# EAGLE design TestBoard2 (EAGLE 9.6.2)

## Sheet 1 of 5
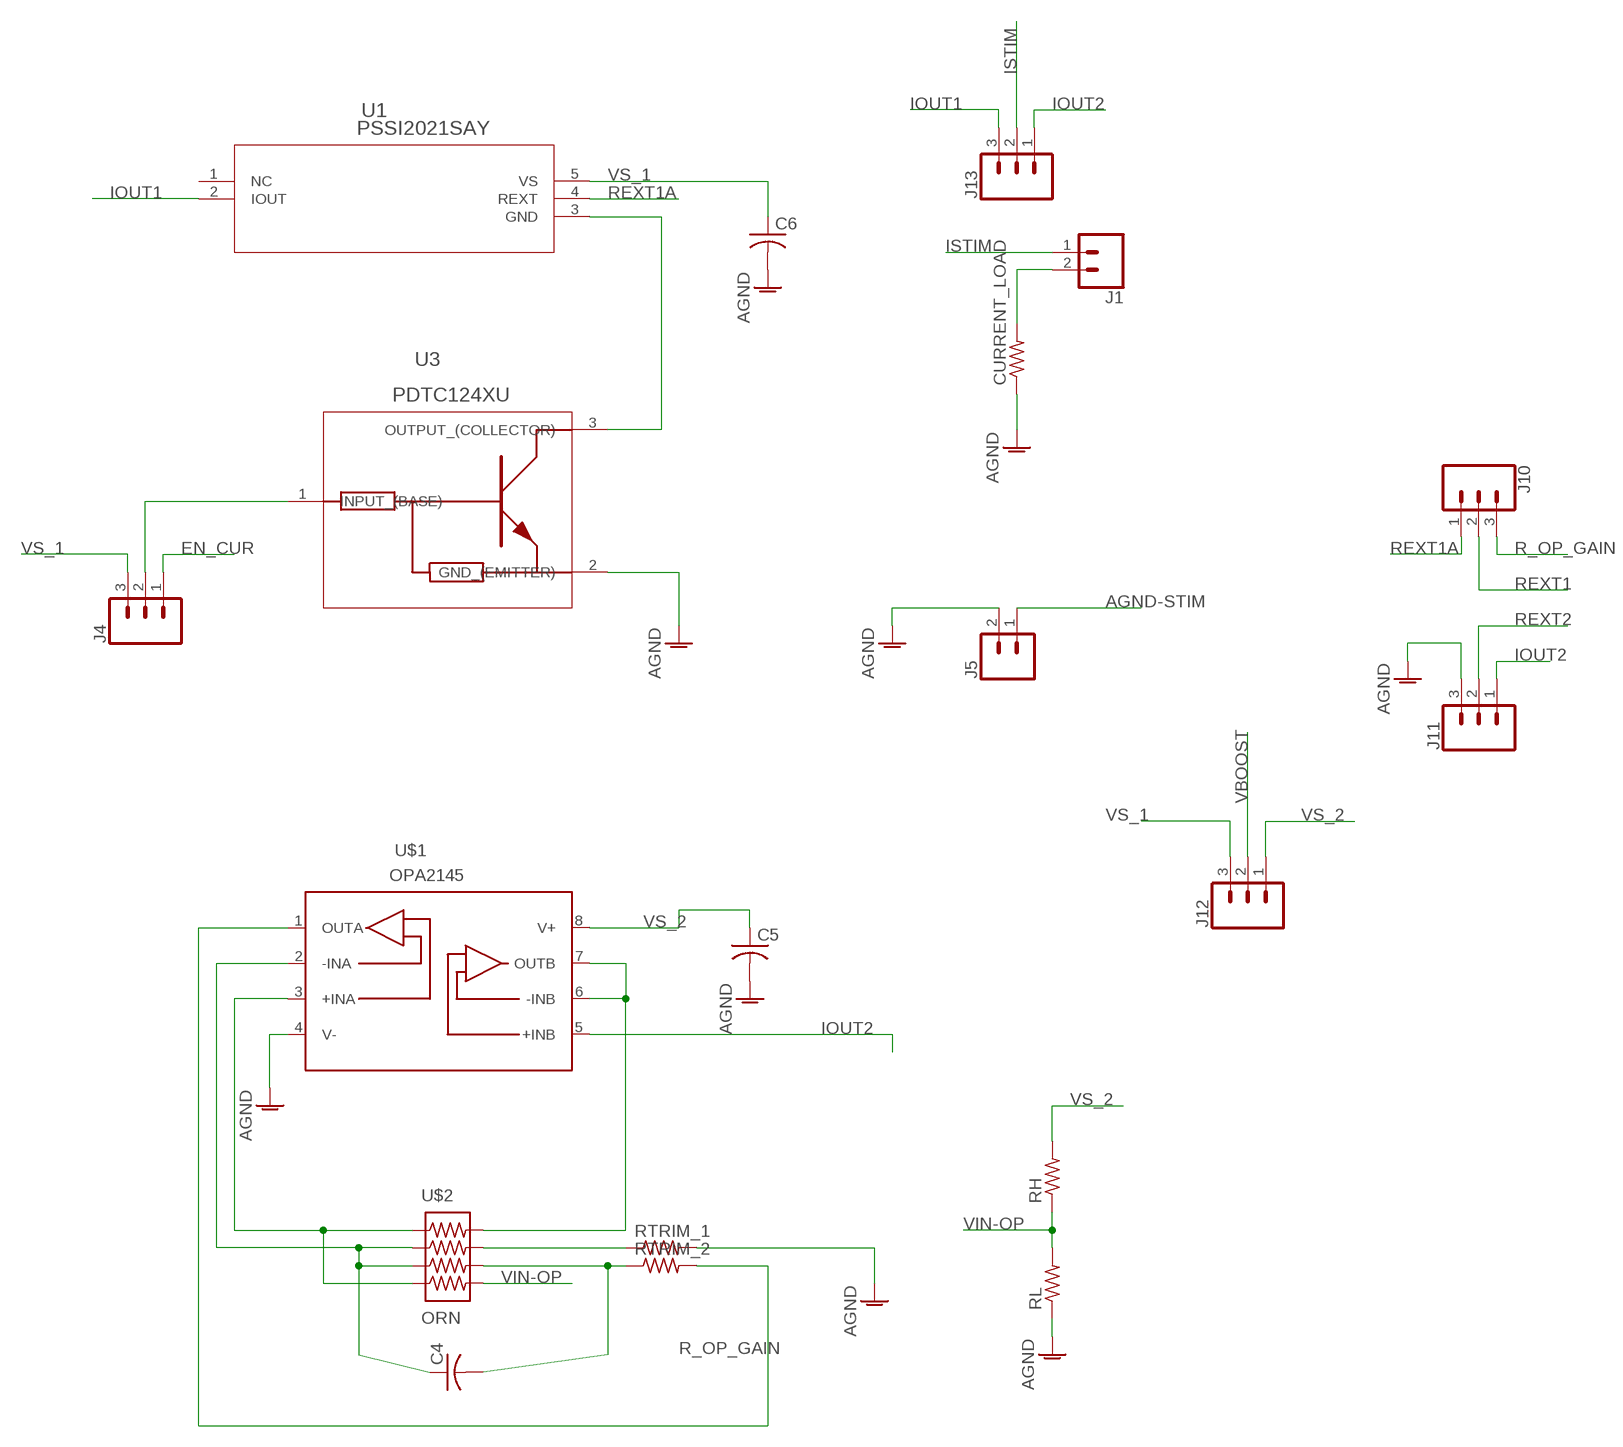
[diagram p0: schematic, sheet 1]

### Parts
C4  C-USC0603  [C0603]
C5  C-USC0603  [C0603]
C6  C-USC0603  [C0603]
CURRENT_LOAD  R-US_0204/7  [0204/7]
J1  CONN_02LOCK  [1X02_LOCK]
J4  CONN_03LOCK  [1X03_LOCK]
J5  CONN_02  [1X02]
J10  CONN_03  [1X03]
J11  CONN_03  [1X03]
J12  CONN_03LOCK  [1X03_LOCK]
J13  CONN_03LOCK  [1X03_LOCK]
RH  R-US_R0603  [R0603]
RL  R-US_R0603  [R0603]
RTRIM_1  R-US_R0603  [R0603]
RTRIM_2  R-US_R0603  [R0603]
U1  PSSI2021SAY  [SOT353_NXP]
U3  PDTC124XU  [SOT323_NXP]
U$1  OPA2145  [8-VSSOP]
U$2  ORN  [8-TSSOP]

### Nets
AGND: C5.2 C6.2 CURRENT_LOAD.1 J5.2 J11.3 RL.1 RTRIM_1.2 U3.2(GND_(EMITTER)) U$1.4(V-) ; also sheet 3
AGND-STIM: J5.1 ; also sheet 4
EN_CUR: J4.1 ; also sheet 5
IOUT1: J13.3 U1.2(IOUT)
IOUT2: J11.1 J13.1 U$1.5(+INB)
ISTIM: J1.1 J13.2 ; also sheet 4
N$1: J4.2 U3.1(INPUT_(BASE))
N$3: CURRENT_LOAD.2 J1.2
N$4: C4.1 U$1.2(-INA) U$2.2 U$2.3
N$6: U1.3(GND) U3.3(OUTPUT_(COLLECTOR))
N$8: U$1.3(+INA) U$2.1 U$2.4
N$9: U$1.6(-INB) U$1.7(OUTB) U$2.8
N$11: RTRIM_1.1 U$2.7
N$12: C4.2 RTRIM_2.1 U$2.6
R_OP_GAIN: J10.3 RTRIM_2.2 U$1.1(OUTA)
REXT1: J10.2 ; also sheet 3
REXT1A: J10.1 U1.4(REXT)
REXT2: J11.2 ; also sheet 3
VBOOST: J12.2 ; also sheet 2,3,4
VIN-OP: RH.1 RL.2 U$2.5
VS_1: C6.1 J4.3 J12.3 U1.5(VS)
VS_2: C5.1 J12.1 RH.2 U$1.8(V+)
Unconnected: U1.1(NC)

## Sheet 2 of 5: Voltage Boost Circuit
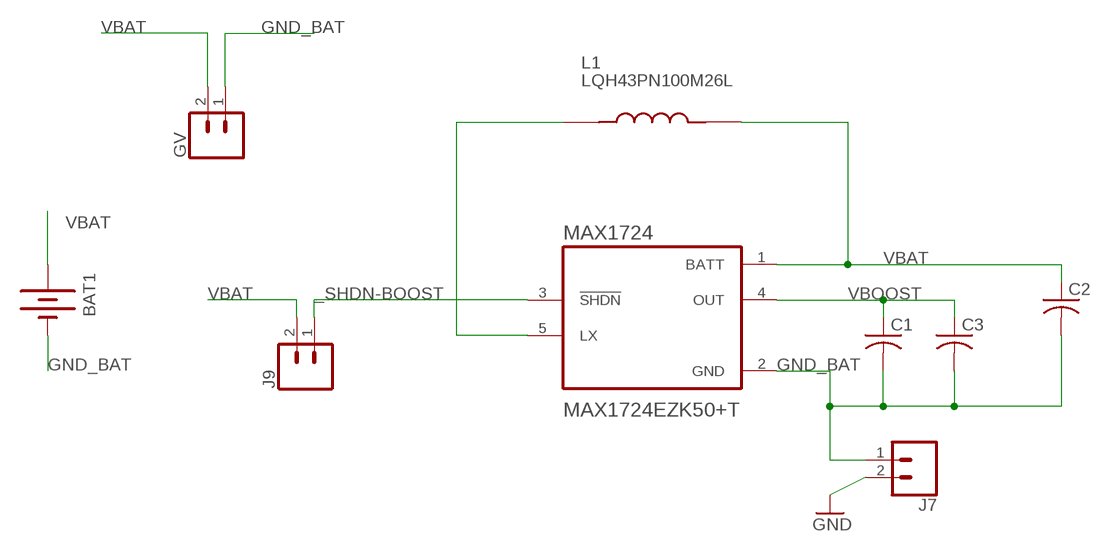
[diagram p1: schematic, sheet 2]

### Parts
BAT1  BATTERYBU2032SM  [BU2032SM]
C1  C-USC1206  [C1206]
C2  C-USC1206  [C1206]
C3  C-USC0603  [C0603]
GV  CONN_02  [1X02]
J7  CONN_02  [1X02]
J9  CONN_02  [1X02]
L1  LQH43PN100M26L  [IND_LQH43PN100M26L]
MAX1724  MAX1724EZK50+T  [SOT95P275X110-5N]

### Nets
_SHDN-BOOST: J9.1 MAX1724.3(!SHDN) ; also sheet 5
GND: J7.2 ; also sheet 4,5
GND_BAT: BAT1.P$2(-) C1.2 C2.2 C3.2 GV.1 J7.1 MAX1724.2(GND)
N$7: L1.1 MAX1724.5(LX)
VBAT: BAT1.P$1(+) C2.1 GV.2 J9.2 L1.2 MAX1724.1(BATT) ; also sheet 5
VBOOST: C1.1 C3.1 MAX1724.4(OUT) ; also sheet 1,3,4

## Sheet 3 of 5: Digital Potentiometer
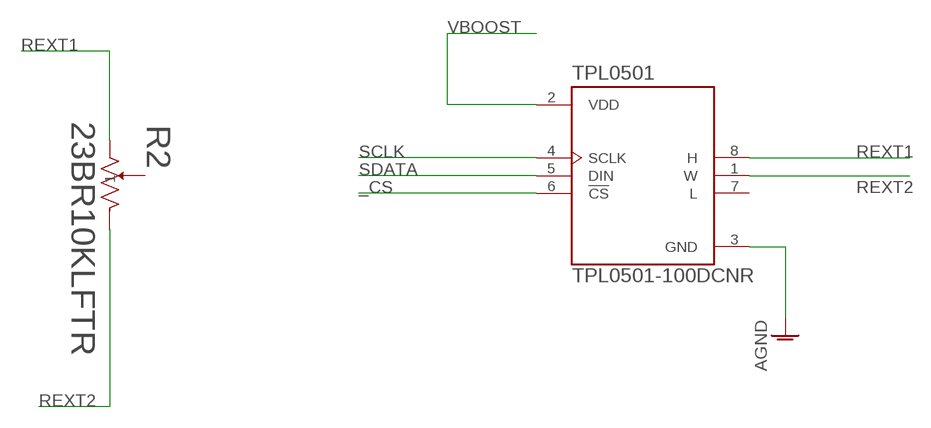
[diagram p2: schematic, sheet 3]

### Parts
R2  23BR10KLFTR  [RES3_23B_TTE]
TPL0501  TPL0501-100DCNR  [SOT65P280X145-8N]

### Nets
_CS: TPL0501.6(!CS!) ; also sheet 5
AGND: TPL0501.3(GND) ; also sheet 1
REXT1: R2.1 TPL0501.8(H) ; also sheet 1
REXT2: R2.3 TPL0501.1(W) ; also sheet 1
SCLK: TPL0501.4(SCLK) ; also sheet 5
SDATA: TPL0501.5(DIN) ; also sheet 5
VBOOST: TPL0501.2(VDD) ; also sheet 1,2,4
Unconnected: R2.2 TPL0501.7(L)

## Sheet 4 of 5: Electrode H-Bridge Multiplexer
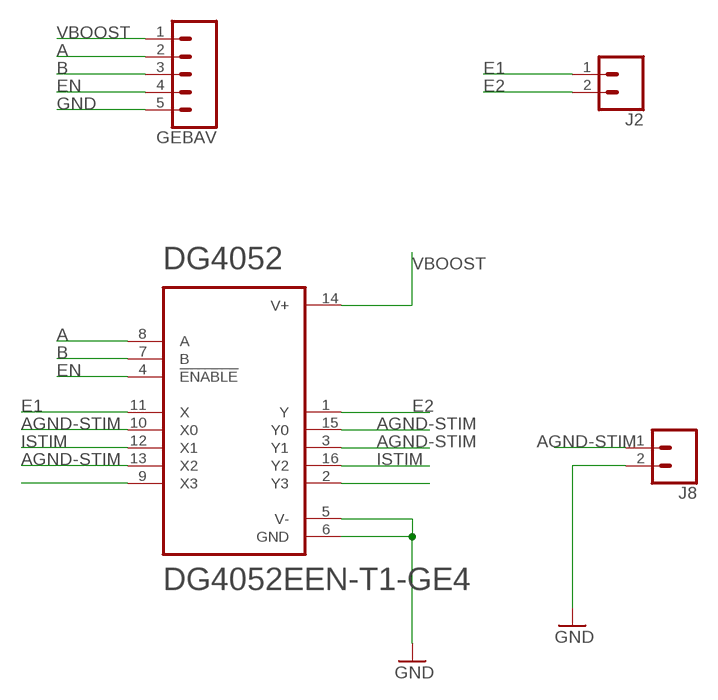
[diagram p3: schematic, sheet 4]

### Parts
DG4052  DG4052EEN-T1-GE4  [QFN40P260X180X60-16N]
GEBAV  CONN_05LOCK  [1X05_LOCK]
J2  CONN_02  [1X02]
J8  CONN_02  [1X02]

### Nets
A: DG4052.8(A) GEBAV.2 ; also sheet 5
AGND-STIM: DG4052.3(Y1) DG4052.10(X0) DG4052.13(X2) DG4052.15(Y0) J8.1 ; also sheet 1
B: DG4052.7(B) GEBAV.3 ; also sheet 5
E1: DG4052.11(X) J2.1
E2: DG4052.1(Y) J2.2
EN: DG4052.4(!ENABLE) GEBAV.4 ; also sheet 5
GND: DG4052.5(V-) DG4052.6(GND) GEBAV.5 J8.2 ; also sheet 2,5
ISTIM: DG4052.12(X1) DG4052.16(Y2) ; also sheet 1
N$2: DG4052.9(X3)
N$5: DG4052.2(Y3)
VBOOST: DG4052.14(V+) GEBAV.1 ; also sheet 1,2,3

## Sheet 5 of 5: MSP430
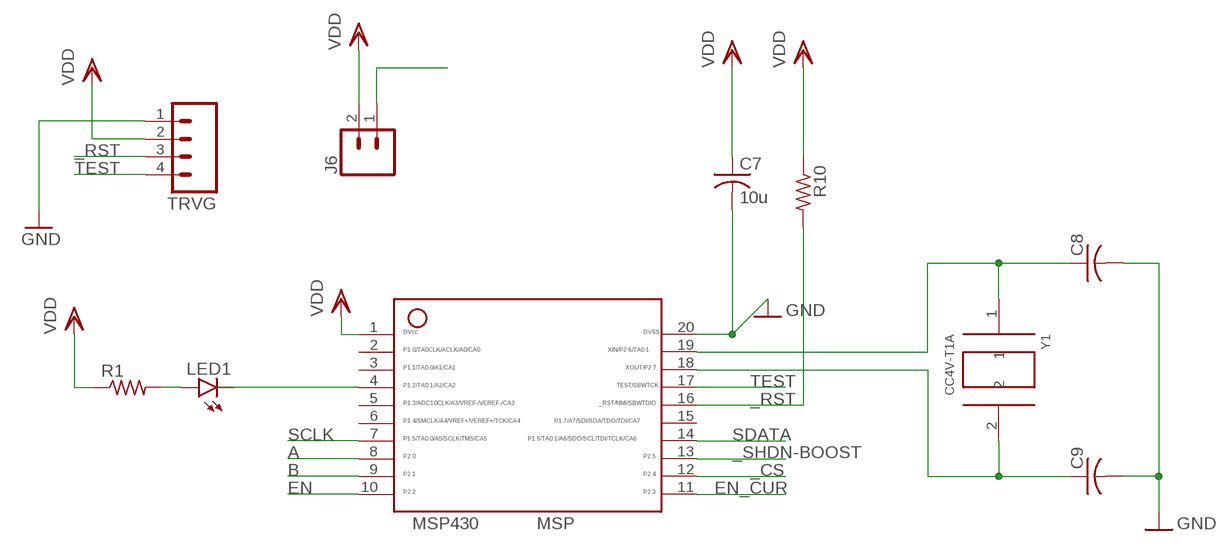
[diagram p4: schematic, sheet 5]

### Parts
C7  10u  C-USC1206  [C1206]
C8  C-USC0603  [C0603]
C9  C-USC0603  [C0603]
J6  CONN_02  [1X02]
LED1  LEDCHIPLED_0603  [CHIPLED_0603]
MSP430  MSP  MSP430  [20_PIN]
R1  R-US_R1206  [R1206]
R10  R-US_R1206  [R1206]
TRVG  M04LOCK  [1X04_LOCK]
Y1  CC4V-T1A  [CC4V-T1A]

### Nets
_CS: MSP430.12 ; also sheet 3
_RST: MSP430.16 R10.2 TRVG.3
_SHDN-BOOST: MSP430.13 ; also sheet 2
A: MSP430.8 ; also sheet 4
B: MSP430.9 ; also sheet 4
EN: MSP430.10 ; also sheet 4
EN_CUR: MSP430.11 ; also sheet 1
GND: C7.2 C8.2 C9.2 MSP430.20 TRVG.1 ; also sheet 2,4
N$10: LED1.C MSP430.4
N$13: LED1.A R1.2
N$14: C8.1 MSP430.19 Y1.1
N$15: C9.1 MSP430.18 Y1.2
SCLK: MSP430.7 ; also sheet 3
SDATA: MSP430.14 ; also sheet 3
TEST: MSP430.17 TRVG.4
VBAT: J6.1 ; also sheet 2
VDD: C7.1 J6.2 MSP430.1 R1.1 R10.1 TRVG.2
Unconnected: MSP430.2 MSP430.3 MSP430.5 MSP430.6 MSP430.15

## Library data of the parts
BAT1 = ELEC327:BATTERY: Battery Holders Various common sizes : AA, AAA, 20mm coin cell and 12mm coin cell. 20MM_4LEGS, BATT-10373
C1-C9 = rcl:C-US: CAPACITOR, American symbol; SPICEPREFIX: C
CURRENT_LOAD R1 R10 RH RL RTRIM_1 RTRIM_2 = rcl:R-US_: RESISTOR, American symbol; SPICEPREFIX: R
DG4052 = DG4052EEN-T1-GE4:DG4052EEN-T1-GE4: DG4052E Series 16 V 78 Ohm High Precision CMOS Analog Multiplexer - miniQFN-16; DESCRIPTION: 2 Circuit IC Switch 4:1 78Ohm 16-miniQFN (1.8x2.6); DIGI-KEY_PART_NUMBER: DG4052EEN-T1-GE4CT-ND; MF: Vishay; MP: DG4052EEN-T1-GE4; PACKAGE: WFQFN-16 Vishay; PURCHASE-URL: https://pricing.snapeda.com/search/part/DG4052EEN-T1-GE4/?ref=eda
GEBAV = SparkFun-Connectors:CONN_05: Multi connection point. Often used as Generic Header-pin footprint for 0.1 inch spaced/style header connections On any of the 0.1 inch spaced packages, you can populate with these: Break Away Headers - Straight <https://www.sparkfun.com/products/116> (PRT-00116) Break Away Male Headers - Right Angle <https://www.sparkfun.com/products/553> (PRT-00553) Female Headers <https://www.sparkfun.com/products/115> (PRT-00115) Break Away Headers - Machine Pin <https://www.sparkfun.com/products/117> (PRT-00117) Break Away Female Headers - Swiss Machine Pin <https://www.sparkfun.com/products/743> (PRT-00743) For SCREWTERMINALS and SPRING TERMINALS visit here: Screw Terimnals on SparkFun.com <https://www.sparkfun.com/search/results?term=Screw+Terminals> (5mm/3.5mm/2.54mm spacing) This device is also useful as a general connection point to wire up your design to another part of your project. Our various solder wires solder well into these plated through hole pads. Hook-Up Wire - Assortment (Stranded, 22 AWG) <https://www.sparkfun.com/products/11375> (PRT-11375) Hook-Up Wire - Assortment (Solid Core, 22 AWG) <https://www.sparkfun.com/products/11367> (PRT-11367) View the entire wire category on our website here <https://www.sparkfun.com/categories/141> Special notes: Molex polarized connector foot print use with SKU : PRT-08231 with associated crimp pins and housings. 1MM SMD Version SKU: PRT-10208
GV J1 J2 J5-J9 = SparkFun-Connectors:CONN_02: Multi connection point. Often used as Generic Header-pin footprint for 0.1 inch spaced/style header connections On any of the 0.1 inch spaced packages, you can populate with these: Break Away Headers - Straight <https://www.sparkfun.com/products/116> (PRT-00116) Break Away Male Headers - Right Angle <https://www.sparkfun.com/products/553> (PRT-00553) Female Headers <https://www.sparkfun.com/products/115> (PRT-00115) Break Away Headers - Machine Pin <https://www.sparkfun.com/products/117> (PRT-00117) Break Away Female Headers - Swiss Machine Pin <https://www.sparkfun.com/products/743> (PRT-00743) For SCREWTERMINALS and SPRING TERMINALS visit here: Screw Terimnals on SparkFun.com <https://www.sparkfun.com/search/results?term=Screw+Terminals> (5mm/3.5mm/2.54mm spacing) This device is also useful as a general connection point to wire up your design to another part of your project. Our various solder wires solder well into these plated through hole pads. Hook-Up Wire - Assortment (Stranded, 22 AWG) <https://www.sparkfun.com/products/11375> (PRT-11375) Hook-Up Wire - Assortment (Solid Core, 22 AWG) <https://www.sparkfun.com/products/11367> (PRT-11367) View the entire wire category on our website here <https://www.sparkfun.com/categories/141> Special notes: Molex polarized connector foot print use with: PRT-08233 with associated crimp pins and housings. 2.54_SCREWTERM for use with PRT-10571. 3.5mm Screw Terminal footprints for PRT-08084 5mm Screw Terminal footprints for use with PRT-08432
J4 J10-J13 = SparkFun-Connectors:CONN_03: Multi connection point. Often used as Generic Header-pin footprint for 0.1 inch spaced/style header connections On any of the 0.1 inch spaced packages, you can populate with these: Break Away Headers - Straight <https://www.sparkfun.com/products/116> (PRT-00116) Break Away Male Headers - Right Angle <https://www.sparkfun.com/products/553> (PRT-00553) Female Headers <https://www.sparkfun.com/products/115> (PRT-00115) Break Away Headers - Machine Pin <https://www.sparkfun.com/products/117> (PRT-00117) Break Away Female Headers - Swiss Machine Pin <https://www.sparkfun.com/products/743> (PRT-00743) Stackable Header - 3 Pin (Female, 0.1") <https://www.sparkfun.com/products/13875> (PRT-13875) For SCREWTERMINALS and SPRING TERMINALS visit here: Screw Terimnals on SparkFun.com <https://www.sparkfun.com/search/results?term=Screw+Terminals> (5mm/3.5mm/2.54mm spacing) This device is also useful as a general connection point to wire up your design to another part of your project. Our various solder wires solder well into these plated through hole pads. Hook-Up Wire - Assortment (Stranded, 22 AWG) <https://www.sparkfun.com/products/11375> (PRT-11375) Hook-Up Wire - Assortment (Solid Core, 22 AWG) <https://www.sparkfun.com/products/11367> (PRT-11367) View the entire wire category on our website here <https://www.sparkfun.com/categories/141> Special notes: Molex polarized connector foot print use with SKU : PRT-08232 with associated crimp pins and housings.
L1 = LQH43PN100M26L:LQH43PN100M26L: Inductor Power Chip Unshielded Wirewound 10uH 10% 1MHz Ferrite 650mA 240mOhm DCR 1812 T/R; DESCRIPTION: Inductor with Inductance: 10uH Tol. +/-20%, Package: 1812 (4532); DIGI-KEY_PART_NUMBER: 490-12780-1-ND; MF: Murata; MP: LQH43PN100M26L; PACKAGE: NONSTANDARD; PURCHASE-URL: https://pricing.snapeda.com/search/part/LQH43PN100M26L/?ref=eda
LED1 = led:LED: LED OSRAM: - CHIPLED LG R971, LG N971, LY N971, LG Q971, LY Q971, LO R971, LY R971 LH N974, LH R974 LS Q976, LO Q976, LY Q976 LO Q996 - Hyper CHIPLED LW Q18S LB Q993, LB Q99A, LB R99A - SideLED LS A670, LO A670, LY A670, LG A670, LP A670 LB A673, LV A673, LT A673, LW A673 LH A674 LY A675 LS A676, LA A676, LO A676, LY A676, LW A676 LS A679, LY A679, LG A679 - Hyper Micro SIDELED® LS Y876, LA Y876, LO Y876, LY Y876 LT Y87S - SmartLED LW L88C, LW L88S LB L89C, LB L89S, LG L890 LS L89K, LO L89K, LY L89K LS L896, LA L896, LO L896, LY L896 - TOPLED LS T670, LO T670, LY T670, LG T670, LP T670 LSG T670, LSP T670, LSY T670, LOP T670, LYG T670 LG T671, LOG T671, LSG T671 LB T673, LV T673, LT T673, LW T673 LH T674 LS T676, LA T676, LO T676, LY T676, LB T676, LH T676, LSB T676, LW T676 LB T67C, LV T67C, LT T67C, LS T67K, LO T67K, LY T67K, LW E67C LS E67B, LA E67B, LO E67B, LY E67B, LB E67C, LV E67C, LT E67C LW T67C LS T679, LY T679, LG T679 LS T770, LO T770, LY T770, LG T770, LP T770 LB T773, LV T773, LT T773, LW T773 LH T774 LS E675, LA E675, LY E675, LS T675 LS T776, LA T776, LO T776, LY T776, LB T776 LHGB T686 LT T68C, LB T68C - Hyper Mini TOPLED® LB M676 - Mini TOPLED Santana® LG M470 LS M47K, LO M47K, LY M47K Source: http://www.osram.convergy.de LUXEON: - LUMILED® LXK2-PW12-R00, LXK2-PW12-S00, LXK2-PW14-U00, LXK2-PW14-V00 LXK2-PM12-R00, LXK2-PM12-S00, LXK2-PM14-U00 LXK2-PE12-Q00, LXK2-PE12-R00, LXK2-PE12-S00, LXK2-PE14-T00, LXK2-PE14-U00 LXK2-PB12-K00, LXK2-PB12-L00, LXK2-PB12-M00, LXK2-PB14-N00, LXK2-PB14-P00, LXK2-PB14-Q00 LXK2-PR12-L00, LXK2-PR12-M00, LXK2-PR14-Q00, LXK2-PR14-R00 LXK2-PD12-Q00, LXK2-PD12-R00, LXK2-PD12-S00 LXK2-PH12-R00, LXK2-PH12-S00 LXK2-PL12-P00, LXK2-PL12-Q00, LXK2-PL12-R00 Source: www.luxeon.com KINGBRIGHT: KA-3528ASYC Source: www.kingbright.com
MAX1724 = MAX1724EZK50_T:MAX1724EZK50+T; DESCRIPTION: Boost Switching Regulator IC Positive Fixed 5V 1 Output 400mA (Switch) SOT-23-5 Thin, TSOT-23-5; DIGI-KEY_PART_NUMBER: MAX1724EZK50+TCT-ND; MF: Maxim Integrated; MP: MAX1724EZK50+T; PACKAGE: SOT-23-5 Maxim; PURCHASE-URL: https://pricing.snapeda.com/search/part/MAX1724EZK50+T/?ref=eda
MSP430 = RatDBS:MSP430: MSP430 20 pins
R2 = trimmer:23BR10KLFTR; COPYRIGHT: Copyright (C) 2016 Accelerated Designs. All rights reserved; MANUFACTURER_PART_NUMBER: 23BR10KLFTR; SOURCELIBRARY: TTELECTRONICS_2018-04-11; VENDOR: TT Electronics
TPL0501 = TPL0501-100DCNR:TPL0501-100DCNR: 256-Taps, 100k, Single-Channel Potentiometer With SPI Interface 8-SOT-23 -40 to 125; DESCRIPTION: 256-Taps, 100k, Single-Channel Potentiometer With SPI Interface 8-SOT-23 -40 to 125; DIGI-KEY_PART_NUMBER: 296-29584-1-ND; MF: Texas Instruments; MP: TPL0501-100DCNR; PACKAGE: SOT-23-8 Texas Instruments; PURCHASE-URL: https://pricing.snapeda.com/search/part/TPL0501-100DCNR/?ref=eda
TRVG = Pendant:M04: Header 4 Standard 4-pin 0.1" header. Use with straight break away headers (SKU : PRT-00116), right angle break away headers (PRT-00553), swiss pins (PRT-00743), machine pins (PRT-00117), and female headers (PRT-00115). Molex polarized connector foot print use with SKU : PRT-08231 with associated crimp pins and housings.
U1 = PSSI2021SAY:PSSI2021SAY; COPYRIGHT: Copyright (C) 2021 Ultra Librarian. All rights reserved.; DIGI-KEY_PART_NUMBER_1: 568-5037-2-ND; DIGI-KEY_PART_NUMBER_2: 568-5037-1-ND; DIGI-KEY_PART_NUMBER_3: 568-5037-6-ND; MANUFACTURER_PART_NUMBER: PSSI2021SAY; MFR_NAME: NXP
U3 = PDTC124XU:PDTC124XU; COPYRIGHT: Copyright (C) 2021 Ultra Librarian. All rights reserved.; DIGI-KEY_PART_NUMBER_1: 568-11253-1-ND; DIGI-KEY_PART_NUMBER_2: 568-11253-6-ND; DIGI-KEY_PART_NUMBER_3: 568-11253-2-ND; MANUFACTURER_PART_NUMBER: PDTC124XU; MFR_NAME: NXP
U$1 = OPA2145:OPA2145
U$2 = ORN:ORN
Y1 = CC4V-T1A-32.768KHZ-7PF-20PPM:CC4V-T1A: Microcrystal CC4V-T1A Low Frequency Tuning Fork Crystal; AVAILABILITY: In Stock; DESCRIPTION: 32.768kHz ±20ppm Crystal 6pF 50 kOhms 2-SMD, No Lead; MF: Micro Crystal AG; MP: CC4V-T1A-32.768KHZ-7PF-20PPM; PACKAGE: SMD-2; PRICE: None; PURCHASE-URL: https://www.digikey.com/en/products/detail/micro-crystal-ag/CC4V-T1A-32-768KHZ-7PF-20PPM-TA-QC/10499071

## Board
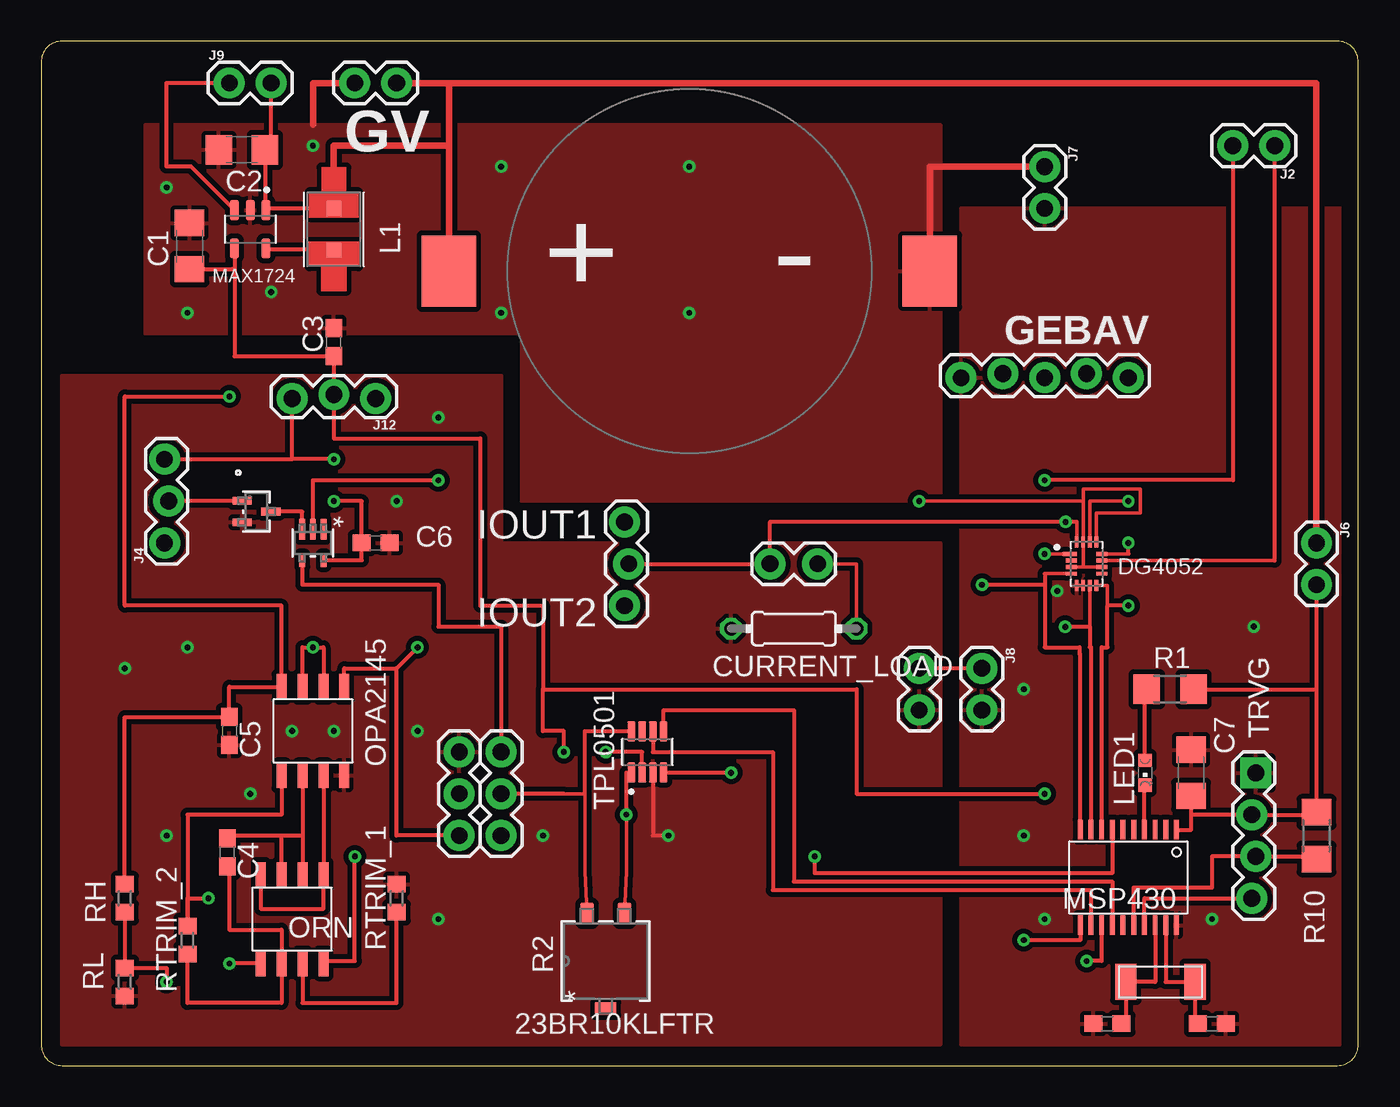
[diagram p5: board, top side]
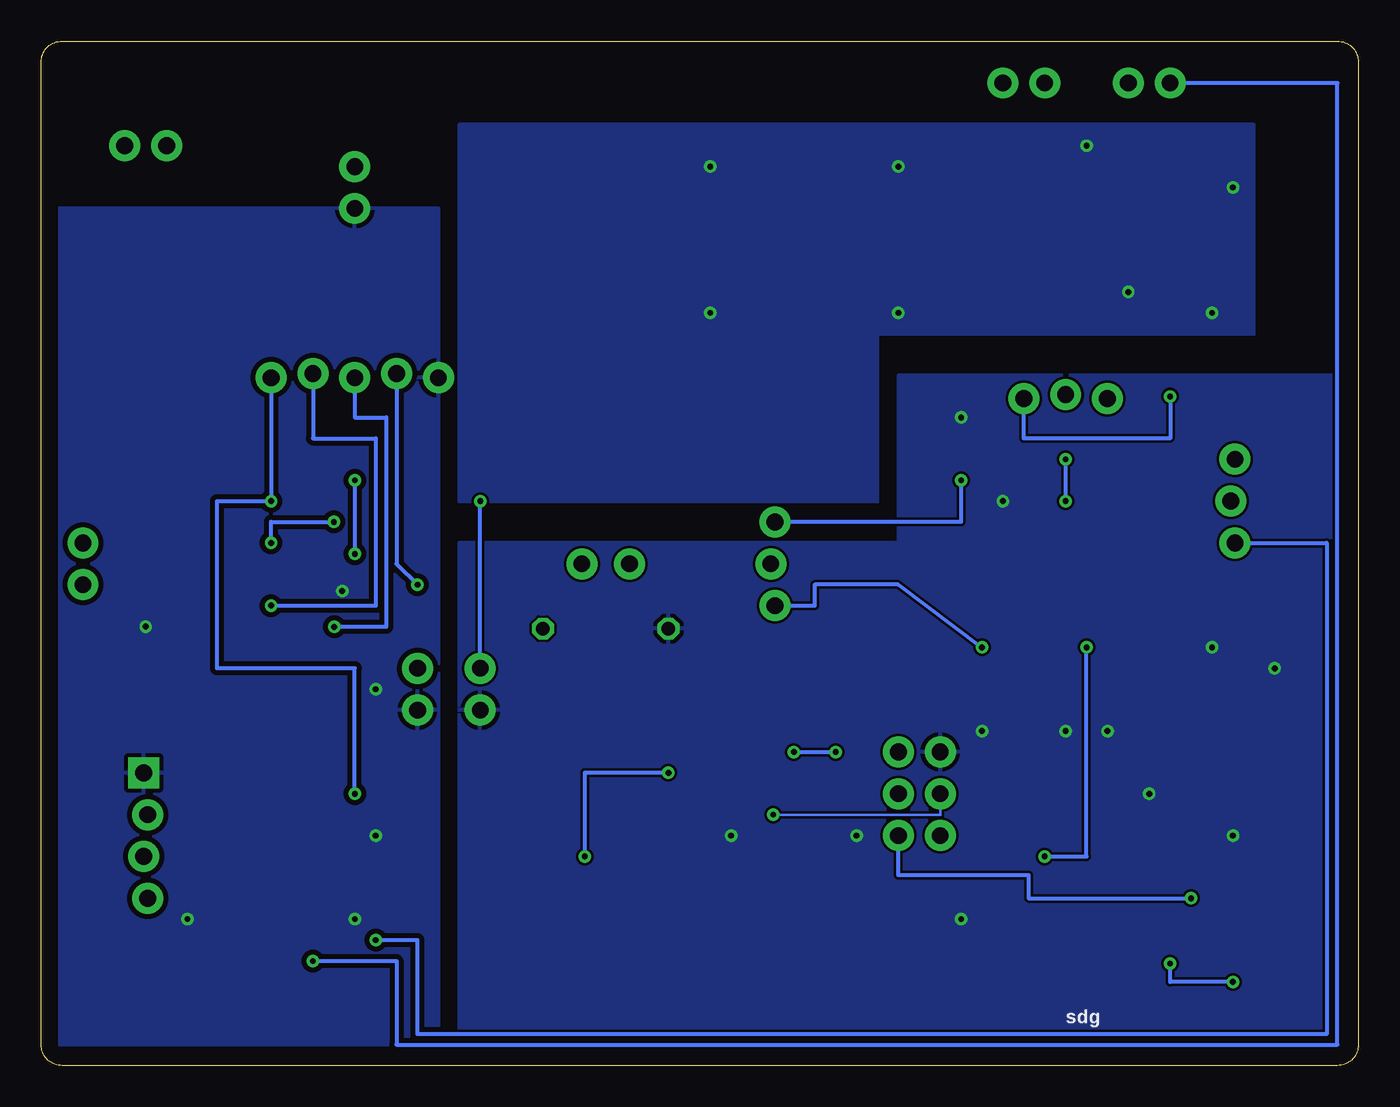
[diagram p6: board, bottom side, seen from below]

Size 80.01 x 62.23 mm. Coordinates in mm from the lower left corner, seen from the top.
Outline: 1.27,0 78.74,0 arc90 80.01,1.27 80.01,60.96 arc90 78.74,62.23 1.27,62.23 arc90 0,60.96 0,1.27 arc90 1.27,0
Copper layers (1*16): Top 0.035mm / dielectric 1.5mm / Bottom 0.035mm
Design rules "default": minimum track width 6mil, minimum drill 0.35mm, track to track 6mil, track to pad 6mil, pad to pad 6mil, via to via 6mil, smd to smd 6mil, copper to edge 40mil, drill to drill 6mil, minimum pad ring 10mil, minimum via ring 8mil, stop-mask expansion 4mil, vias tented up to drill 0mil, thermal gap 10mil

### Footprints (pad centres in the part's own frame; a part is rotated, then mirrored left to right if it is on the bottom)
BU2032SM = smd 3.302 x 4.318: P$1 -14.605,0; P$2 14.605,0
C1206 = smd 1.6 x 1.8: 1 -1.4,0; 2 1.4,0
C0603 = smd 1.1 x 1: 1 -0.85,0; 2 0.85,0
0204/7 = drill 0.813 octagon: 1 -3.81,0; 2 3.81,0
QFN40P260X180X60-16N = smd 0.863 x 0.225: 1 -1.018,0.6 | smd 0.663 x 0.225: 2 -0.918,0.2; 3 -0.918,-0.2; 4 -0.918,-0.6; 9 0.918,-0.6; 10 0.918,-0.2; 11 0.918,0.2; 12 0.918,0.6 | smd 0.225 x 0.663: 5 -0.6,-1.319; 6 -0.2,-1.319; 7 0.2,-1.319; 8 0.6,-1.319; 13 0.6,1.319; 14 0.2,1.319; 15 -0.2,1.319; 16 -0.6,1.319
1X05_LOCK = drill 1.016 pad 1.88: 1 0,0.127; 2 2.54,-0.127; 3 5.08,0.127; 4 7.62,-0.127; 5 10.16,0.127
1X02 = drill 1.016 pad 1.88: 1 0,0; 2 2.54,0
1X02_LOCK = drill 1.016 pad 1.88: 1 -0.178,0; 2 2.718,0
1X03_LOCK = drill 1.016 pad 1.88: 1 0,0.127; 2 2.54,-0.127; 3 5.08,0.127
1X03 = drill 1.016 pad 1.88: 1 0,0; 2 2.54,0; 3 5.08,0
IND_LQH43PN100M26L = smd 0.9 x 0.9: 1 -1.25,0; 2 1.25,0
CHIPLED_0603 = smd 0.8 x 0.8: A 0,-0.75; C 0,0.75
SOT95P275X110-5N = smd 1.24 x 0.55: 1 -1.16,0.95; 2 -1.16,0; 3 -1.16,-0.95; 4 1.16,-0.95; 5 1.16,0.95
20_PIN = smd 0.3 x 1.2: 1 -2.925,-2.9; 2 -2.275,-2.9; 3 -1.625,-2.9; 4 -0.975,-2.9; 5 -0.325,-2.9; 6 0.325,-2.9; 7 0.975,-2.9; 8 1.625,-2.9; 9 2.275,-2.9; 10 2.925,-2.9; 11 2.925,2.9; 12 2.275,2.9; 13 1.625,2.9; 14 0.975,2.9; 15 0.325,2.9; 16 -0.325,2.9; 17 -0.975,2.9; 18 -1.625,2.9; 19 -2.275,2.9; 20 -2.925,2.9
R1206 = smd 1.6 x 1.803: 1 -1.422,0; 2 1.422,0
RES3_23B_TTE = smd 1.27 x 0.813: 1 2.896,1.143; 3 2.896,-1.143 | smd 0.762 x 1.27: 2 -2.896,0
R0603 = smd 1 x 1.1: 1 -0.85,0; 2 0.85,0
SOT65P280X145-8N = smd 1.21 x 0.48: 1 -1.255,0.975; 2 -1.255,0.325; 3 -1.255,-0.325; 4 -1.255,-0.975; 5 1.255,-0.975; 6 1.255,-0.325; 7 1.255,0.325; 8 1.255,0.975
1X04_LOCK = drill 1.016 pad 1.88 square: 1 0,0.127 | drill 1.016 pad 1.88: 2 2.54,-0.127; 3 5.08,0.127; 4 7.62,-0.127
SOT353_NXP = smd 1.27 x 0.356: 1 -0.826,0.65; 2 -0.826,0; 3 -0.826,-0.65 | smd 0.813 x 0.356: 4 1.054,-0.65; 5 1.054,0.65
SOT323_NXP = smd 0.457 x 1.168: 1 -0.65,-0.876; 2 0.65,-0.876; 3 0,0.876
8-VSSOP = smd 1.549 x 0.61: 1 -2.692,1.905; 2 -2.692,0.635; 3 -2.692,-0.635; 4 -2.692,-1.905; 5 2.692,-1.905; 6 2.692,-0.635; 7 2.692,0.635; 8 2.692,1.905
8-TSSOP = smd 1.549 x 0.61: 1 -2.692,1.905; 2 -2.692,0.635; 3 -2.692,-0.635; 4 -2.692,-1.905; 5 2.692,-1.905; 6 2.692,-0.635; 7 2.692,0.635; 8 2.692,1.905
CC4V-T1A = smd 1.3 x 2.2: 1 -2.1,0; 2 2.1,0

### Placement (x,y rotation side)
BAT1  39.37,48.26 0 top
C1  9.02,49.78 90 top
C2  12.19,55.63 180 top
C3  17.78,43.94 90 top
C4  11.3,12.95 270 top
C5  11.43,20.32 270 top
C6  20.32,31.75 0 top
C7  69.85,17.78 90 top
C8  71.12,2.54 0 top
C9  64.77,2.54 180 top
CURRENT_LOAD  45.72,26.54 0 top
DG4052  63.5,30.48 0 top
GEBAV  66.04,41.91 180 top
GV  19.05,59.69 0 top
J1  44.45,30.48 0 top
J2  74.93,55.88 180 top
J4  7.62,31.75 90 top
J5  53.34,24.13 270 top
J6  77.47,31.75 270 top
J7  60.96,54.61 270 top
J8  57.15,24.13 270 top
J9  11.43,59.69 0 top
J10  27.94,19.05 270 top
J11  25.4,13.97 90 top
J12  20.32,40.64 180 top
J13  35.56,27.94 90 top
L1  17.78,50.8 90 top
LED1  67.06,17.78 180 top
MAX1724  12.7,50.8 270 top
MSP430  66.04,11.43 180 top
R1  68.58,22.86 180 top
R2  34.29,6.35 90 top
R10  77.47,13.97 270 top
RH  5.08,10.16 90 top
RL  5.08,5.08 90 top
RTRIM_1  21.59,10.16 90 top
RTRIM_2  8.89,7.62 90 top
TPL0501  36.83,19.05 90 top
TRVG  73.66,17.78 270 top
U1  16.51,31.75 270 top
U3  13.08,33.66 270 top
U$1  16.51,20.32 90 top
U$2  15.24,8.89 270 top
Y1  67.99,5.08 180 top

### Tracks (layer width: path | path; a pad name or v marks a point on that pad's centre or on a via)
_CS
  Top 0.254: TPL0501.6 37.16,19.05 44.45,19.05 44.45,10.67 63.77,10.67 MSP430.12
_RST
  Top 0.152: 77.47,12.7 R10.2
  Top 0.254: MSP430.16 66.36,10.79 71.12,10.79 71.12,12.7 TRVG.3 77.47,12.7
_SHDN-BOOST  (via drill 0.35)
  Top 0.254: J9.1 7.62,59.69 7.62,54.61 9.1,54.61 MAX1724.3 | MSP430.13 64.42,6.35 v63.5,6.35
  Bottom 0.254: v63.5,6.35 58.42,6.35 58.42,1.27 1.27,1.27 1.27,59.69 J9.1
A  (via drill 0.35)
  Top 0.203: 64.77,27.94 64.77,29.16 DG4052.8
  Top 0.254: MSP430.8 64.42,25.4 64.77,25.4 64.77,27.94 v66.04,27.94
  Bottom 0.254: GEBAV.2 63.5,38.1 59.69,38.1 59.69,27.94 v66.04,27.94
AGND  (via drill 0.35)
  Top 0.254: TPL0501.3 37.16,13.97 v38.1,13.97
  other vias: 8.89,25.4 17.78,20.32 15.24,20.32 22.86,20.32 24.13,39.37 24.13,8.89 7.62,13.97 12.7,16.51 21.59,34.29 30.48,13.97 5.08,24.13
  pour Top (isolate 0.305): 1.27,41.91 27.94,41.91 27.94,31.75 54.61,31.75 54.61,1.27 1.27,1.27
  pour Bottom: 1.27,41.91 27.94,41.91 27.94,31.75 54.61,31.75 54.61,1.27 1.27,1.27
AGND-STIM  (via drill 0.35)
  Top 0.203: v53.34,34.29 63.3,34.29 | 63.3,34.29 DG4052.15 63.3,30.28 | DG4052.10 63.3,30.28 | 63.3,30.28 DG4052.3 | DG4052.13 64.1,33.56 66.77,33.56 66.77,35.02 63.3,35.02 63.3,34.29
  Top 0.254: J8.1 J5.1
  Bottom 0.254: J5.1 v53.34,34.29
B  (via drill 0.35)
  Top 0.203: DG4052.7 63.69,26.67
  Top 0.254: DG4052.7 | MSP430.9 63.77,25.4 63.69,25.4 63.69,26.67 62.21,26.67 v62.21,26.65
  Bottom 0.254: GEBAV.3 60.96,39.37 59.05,39.37 59.05,26.65 v62.21,26.65
E1
  Top 0.203: DG4052.11 74.93,30.68
  Top 0.254: 74.93,30.68 J2.1
E2  (via drill 0.35)
  Top 0.203: DG4052.1 v60.96,31.08
  Top 0.254: J2.2 72.39,35.56 v60.96,35.56
  Bottom 0.254: v60.96,35.56 v60.96,31.08
EN  (via drill 0.35)
  Top 0.203: DG4052.4 60.96,29.88
  Top 0.254: MSP430.10 63.12,24.99 63.09,24.99 63.09,25.4 60.96,25.4 60.96,29.21 | 60.96,29.88 60.96,29.21 | v57.15,29.21 60.96,29.21
  Bottom 0.254: GEBAV.4 58.42,30.48 v57.15,29.21
EN_CUR  (via drill 0.35)
  Top 0.254: MSP430.11 63.12,7.62 v59.69,7.62
  Bottom 0.254: v59.69,7.62 57.15,7.62 57.15,1.91 1.93,1.91 1.93,31.75 J4.1
GND  (via drill 0.35)
  Top 0.203: DG4052.5 DG4052.6
  other vias: 73.66,26.67 61.72,28.83 59.69,22.86 71.12,8.89 60.96,8.89 59.69,13.97
  pour Bottom (isolate 0.305): 80.01,1.27 55.88,1.27 55.88,52.07 80.01,52.07
  pour Top (isolate 0.305): 80.01,52.07 80.01,1.27 55.88,1.27 55.88,52.07
GND_BAT  (via drill 0.35)
  Top 0.406: BAT1.P$2 53.98,54.61 J7.1 | GV.1 16.51,59.69 16.51,57.15
  other vias: 16.51,55.88 27.94,54.61 39.37,54.61 39.37,45.72 27.94,45.72 13.97,46.99 7.62,53.34 8.89,45.72
  pour Top (isolate 0.305): 6.35,57.15 54.61,57.15 54.61,34.29 29.21,34.29 29.21,44.45 6.35,44.45
  pour Bottom: 6.35,57.15 54.61,57.15 54.61,34.29 29.21,34.29 29.21,44.45 6.35,44.45
IOUT1  (via drill 0.35)
  Top 0.254: U1.2 16.51,35.56 v24.13,35.56
  Bottom 0.254: J13.3 24.13,33.02 v24.13,35.56
IOUT2  (via drill 0.35)
  Top 0.254: U$1.5 18.41,24.13 21.59,24.13 | J11.1 21.59,13.97 21.59,24.13 | 21.59,24.13 v22.86,25.4
  Bottom 0.254: J13.1 33.02,27.94 33.02,29.21 27.94,29.21 v22.86,25.4
ISTIM  (via drill 0.35)
  Top 0.203: DG4052.16 62.9,33.02 | DG4052.12 66.04,31.09
  Top 0.254: J13.2 J1.1 44.27,33.02 v62.23,33.02 62.9,33.02 | 66.04,31.09 v66.04,31.75
  Bottom 0.254: v66.04,31.75 66.04,33.02 v62.23,33.02
N$1
  Top 0.254: J4.2 8.89,34.29 8.89,34.3 U3.1
N$3
  Top 0.203: CURRENT_LOAD.2 49.53,30.48 J1.2
N$4
  Top 0.254: U$1.2 15.88,13.97 | 15.88,13.97 U$2.2 | U$2.3 14.61,13.97 | 14.61,13.97 15.88,13.97 | C4.1 11.3,13.97 14.61,13.97
N$6
  Top 0.254: U1.3 15.86,33.66 U3.3
N$7
  Top 0.254: L1.1 13.65,49.55 MAX1724.5
N$8
  Top 0.254: U$1.3 U$2.1 17.14,9.53 13.34,9.53 U$2.4
N$9  (via drill 0.35)
  Top 0.254: U$2.8 17.14,6.35 19.05,6.35 v19.05,12.7 | U$1.6 17.14,25.4 v16.51,25.4 15.88,25.4 U$1.7
  Bottom 0.254: v19.05,12.7 16.51,12.7 v16.51,25.4
N$10
  Top 0.254: MSP430.4 67.02,17.03 LED1.C
N$11
  Top 0.254: U$2.7 15.88,3.81 21.59,3.81 RTRIM_1.1
N$12
  Top 0.254: RTRIM_2.1 8.89,3.81 14.61,3.81 U$2.6 14.61,8.26 11.43,8.26 11.43,12.1 C4.2
N$13
  Top 0.254: LED1.A 67.06,22.86 R1.2
N$14
  Top 0.254: MSP430.19 68.31,5.08 Y1.1 70.09,2.72 C8.1
N$15
  Top 0.254: MSP430.18 67.67,5.08 Y1.2 65.89,2.81 C9.1
R_OP_GAIN  (via drill 0.35)
  Top 0.254: U$1.1 14.61,15.24 8.89,15.24 RTRIM_2.2 8.89,10.16 v10.16,10.16
  Bottom 0.254: v10.16,10.16 20.04,10.16 20.04,11.55 27.94,11.55 J10.3
REXT1
  Top 0.203: R2.1 33.03,11.79 33.03,16.51 33.02,16.51 31.75,16.51
  Top 0.254: 31.75,16.51 J10.2 | TPL0501.8 33.02,20.3 33.02,16.51
REXT1A
  Top 0.254: U1.4 15.86,29.21 24.13,29.21 24.13,26.67 27.94,26.67 J10.1
REXT2  (via drill 0.35)
  Top 0.203: v35.55,15.24 35.55,11.79 R2.3
  Top 0.254: v35.55,15.24 35.55,17.8 TPL0501.1
  Bottom 0.152: v35.55,15.24 25.4,15.24 J11.2
SCLK  (via drill 0.35)
  Top 0.254: MSP430.7 65.06,11.68 46.99,11.68 v46.99,12.7 | TPL0501.4 41.91,17.8 v41.91,17.78
  Bottom 0.254: v41.91,17.78 46.99,17.78 v46.99,12.7
SDATA
  Top 0.254: TPL0501.5 37.8,21.59 45.72,21.59 45.72,11.18 65.06,11.18 MSP430.14
TEST
  Top 0.254: MSP430.17 67.02,10.16 TRVG.4
VBAT
  Top 0.254: L1.2 13.74,52.05 MAX1724.1 13.65,55.57 C2.1 13.97,56 J9.2
  Top 0.406: L1.2 17.78,55.88 24.77,55.88 BAT1.P$1 24.77,59.69 | J6.1 77.47,59.69 24.77,59.69 | GV.2 24.77,59.69
VBOOST  (via drill 0.35)
  Top 0.203: DG4052.14 63.7,34.29 v66.04,34.29
  Top 0.254: MAX1724.4 11.75,48.26 | 11.75,48.26 11.75,43.09 C3.1 J12.2 17.78,38.1 26.67,38.1 26.67,27.94 30.48,27.94 30.48,22.86 | C1.1 11.63,48.38 11.75,48.26 | TPL0501.2 36.51,19.05 v34.29,19.05 | v31.75,19.05 31.75,20.32 30.48,20.32 30.48,22.86 | 30.48,22.86 49.53,22.86 49.53,16.51 v60.96,16.51
  Bottom 0.254: v34.29,19.05 v31.75,19.05 | GEBAV.1 v66.04,34.29 69.34,34.29 69.34,24.13 60.96,24.13 v60.96,16.51
VDD
  Top 0.152: 77.47,15.24 R10.1
  Top 0.254: R1.1 77.47,22.86 | 77.47,22.86 77.47,15.24 TRVG.2 69.85,15.24 | 69.85,15.24 C7.1 | MSP430.1 69.85,14.33 69.85,15.24 | J6.2 77.47,22.86
VIN-OP  (via drill 0.35)
  Top 0.254: U$2.5 v11.43,6.2 | RH.1 RL.2 7.62,5.93 v7.62,5.08
  Bottom 0.254: v7.62,5.08 11.43,5.08 v11.43,6.2
VS_1  (via drill 0.35)
  Top 0.254: 15.24,36.83 J12.3 | J4.3 15.24,36.83 | U1.5 19.47,30.7 C6.1 19.47,34.29 v17.78,34.29 | v17.78,36.83 15.24,36.83
  Bottom 0.254: v17.78,34.29 v17.78,36.83
VS_2  (via drill 0.35)
  Top 0.254: v11.43,40.64 5.08,40.64 5.08,27.94 14.61,27.94 U$1.8 11.43,23.01 C5.1 5.08,21.17 RH.2
  Bottom 0.254: v11.43,40.64 11.43,38.1 20.32,38.1 J12.1

### Text on the board
tPlace: IOUT1 / / IOUT2
bPlace: sdg